# EAGLE schematic bottom (EAGLE 7.2.0)
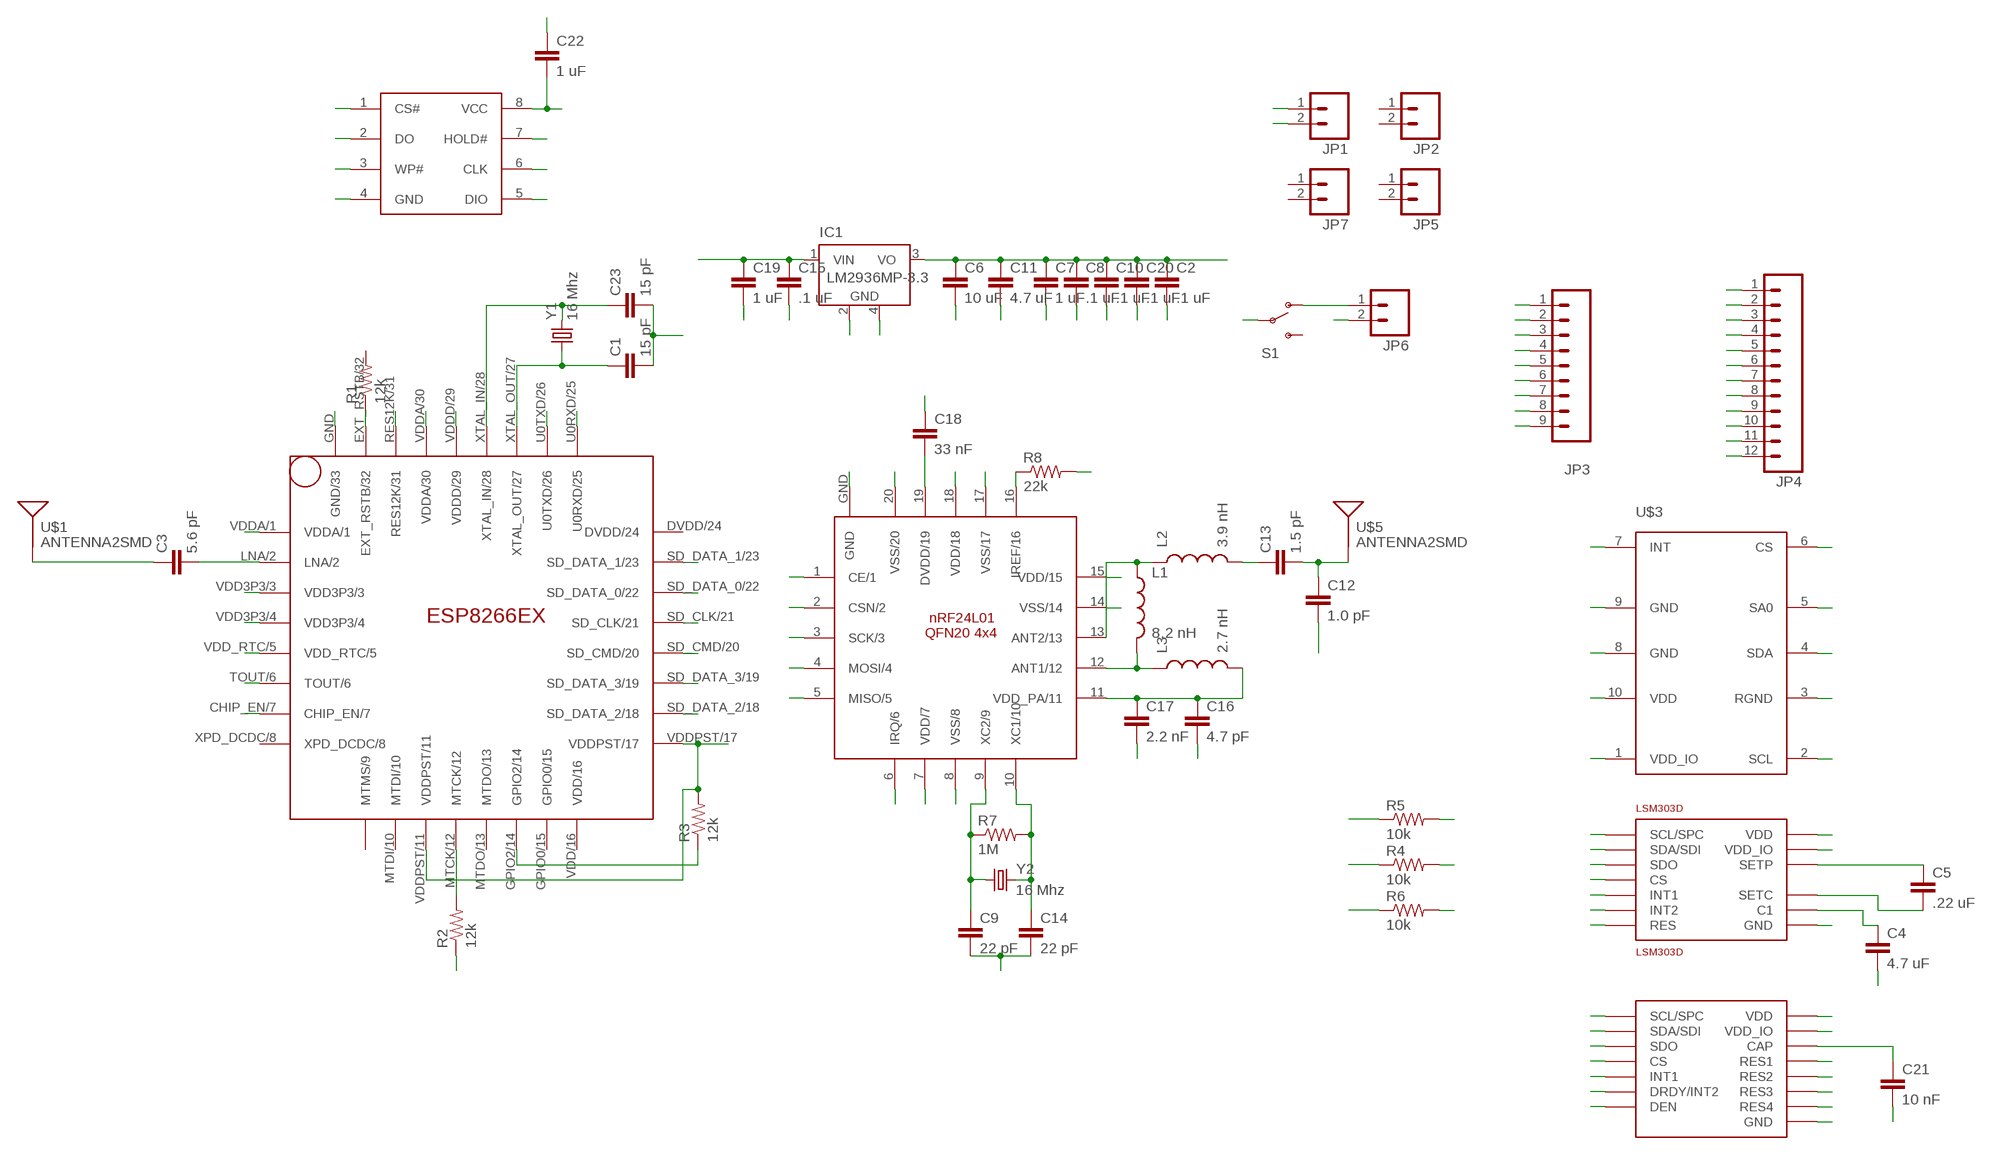
[diagram p0: schematic, sheet 1]

## Parts
C1  15 pF  CAP0603-CAP  [0603-CAP]
C2  .1 uF  CAP0603-CAP  [0603-CAP]
C3  5.6 pF  CAP0603-CAP  [0603-CAP]
C4  4.7 uF  CAP0603-CAP  [0603-CAP]
C5  .22 uF  CAP0603-CAP  [0603-CAP]
C6  10 uF  CAP0603-CAP  [0603-CAP]
C7  1 uF  CAP0603-CAP  [0603-CAP]
C8  .1 uF  CAP0603-CAP  [0603-CAP]
C9  22 pF  CAP0603-CAP  [0603-CAP]
C10  .1 uF  CAP0603-CAP  [0603-CAP]
C11  4.7 uF  CAP0603-CAP  [0603-CAP]
C12  1.0 pF  CAP0603-CAP  [0603-CAP]
C13  1.5 pF  CAP0603-CAP  [0603-CAP]
C14  22 pF  CAP0603-CAP  [0603-CAP]
C15  .1 uF  CAP0603-CAP  [0603-CAP]
C16  4.7 pF  CAP0603-CAP  [0603-CAP]
C17  2.2 nF  CAP0603-CAP  [0603-CAP]
C18  33 nF  CAP0603-CAP  [0603-CAP]
C19  1 uF  CAP0603-CAP  [0603-CAP]
C20  .1 uF  CAP0603-CAP  [0603-CAP]
C21  10 nF  CAP0603-CAP  [0603-CAP]
C22  1 uF  CAP0603-CAP  [0603-CAP]
C23  15 pF  CAP0603-CAP  [0603-CAP]
IC1  LM2936MP-3.3  [SOT223]
JP1  M02LOCK  [1X02_LOCK]
JP2  M02LOCK  [1X02_LOCK]
JP3  M09  [1X09]
JP4  M12PTH  [1X12]
JP5  M02LOCK  [1X02_LOCK]
JP6  M02LOCK  [1X02_LOCK]
JP7  M02LOCK  [1X02_LOCK]
L1  8.2 nH  INDUCTOR0402  [C0402]
L2  3.9 nH  INDUCTOR0402  [C0402]
L3  2.7 nH  INDUCTOR0402  [C0402]
LSM303D  LSM303D  [LGA16L]
MESH  NRF24L01  [QFN20(4X4)]
R1  12k  RESISTOR0603-RES  [0603-RES]
R2  12k  RESISTOR0603-RES  [0603-RES]
R3  12k  RESISTOR0603-RES  [0603-RES]
R4  10k  RESISTOR0603-RES  [0603-RES]
R5  10k  RESISTOR0603-RES  [0603-RES]
R6  10k  RESISTOR0603-RES  [0603-RES]
R7  1M  RESISTOR0603-RES  [0603-RES]
R8  22k  RESISTOR0603-RES  [0603-RES]
S1  SWITCH-SPDT-SMD-A  [SWITCH-SPST-SMD-A]
U$1  ANTENNA2SMD  [ANTENNA-CHIP2]
U$2  25Q40  [SOP8]
U$3  LPS25H  [LPS25H]
U$4  L3GD20H  [LGA16L]
U$5  ANTENNA2SMD  [ANTENNA-CHIP2]
WIFI  ESP8266EX  [QFN32]
Y1  16 Mhz  CRYSTAL5X3  [CRYSTAL-SMD-5X3]
Y2  16 Mhz  CRYSTAL5X3  [CRYSTAL-SMD-5X3]

## Nets
CE: JP3.3 MESH.1(CE/1)
CSN: JP3.4 MESH.2(CSN/2)
GND: C1.2 C2.2 C4.2 C6.2 C7.2 C8.2 C9.2 C10.2 C11.2 C12.2 C14.2 C15.2 C16.2 C17.2 C18.1 C19.2 C20.2 C22.1 C23.2 IC1.2(GND) IC1.4(GND) JP1.2 JP4.1 JP4.2 JP4.3 JP4.4 JP4.5 JP4.6 JP6.2 LSM303D.P$5(GND) LSM303D.P$10(RES) LSM303D.P$12(GND) LSM303D.P$13(GND) LSM303D.P$16(GND) MESH.8(VSS/8) MESH.14(VSS/14) MESH.17(VSS/17) MESH.20(VSS/20) R2.1 R8.2 U$2.4(GND) U$3.3(RGND) U$3.8(GND) U$3.9(GND) U$4.P$8(DEN) U$4.P$9(RES1) U$4.P$10(RES2) U$4.P$11(RES3) U$4.P$12(GND) U$4.P$13(GND) WIFI.GND(GND/33)
IQR: MESH.6(IRQ/6)
MISO: JP3.6 MESH.5(MISO/5)
MOSI: JP3.5 MESH.4(MOSI/4)
N$1: C3.1 U$1.FEED(SIGNAL)
N$2: R3.1 WIFI.GPIO2/14
N$3: R2.2 WIFI.MTCK/12
N$5: L1.2 L3.1 MESH.12(ANT1/12)
N$6: C13.1 L2.2
N$10: C12.1 C13.2 U$5.FEED(SIGNAL)
N$11: U$4.P$7(INT1)
N$12: U$4.P$6(DRDY/INT2)
N$13: C3.2 WIFI.LNA/2
N$14: U$3.7(INT)
N$16: C9.1 MESH.9(XC2/9) R7.1 Y2.1
N$17: C14.1 MESH.10(XC1/10) R7.2 Y2.3
N$18: C16.1 C17.1 L3.2 MESH.11(VDD_PA/11)
N$19: L1.1 L2.1 MESH.13(ANT2/13)
N$22: C21.1 U$4.P$14(CAP)
N$24: MESH.16(IREF/16) R8.1
N$28: C18.2 MESH.19(DVDD/19)
N$30: MESH.GND
N$31: C21.2
N$35: LSM303D.P$11(INT1)
N$36: LSM303D.P$9(INT2)
N$38: WIFI.RES12K/31
N$42: C5.2 LSM303D.P$2(SETC)
N$43: C4.1 LSM303D.P$15(C1)
RST: R1.1 WIFI.EXT_RSTB/32
RTC: WIFI.VDD_RTC/5
RX_W: JP3.1 WIFI.U0TXD/26
SCK: JP3.7 MESH.3(SCK/3)
SCL: JP3.9 LSM303D.P$4(SCL/SPC) R4.2 U$3.2(SCL) U$4.P$2(SCL/SPC)
SD-CLK: U$2.6(CLK) WIFI.SD_CLK/21
SD-CMD: U$2.1(CS#) WIFI.SD_CMD/20
SD-D0: U$2.2(DO) WIFI.SD_DATA_0/22
SD-D1: U$2.5(DIO) WIFI.SD_DATA_1/23
SD-D2: U$2.7(HOLD#) WIFI.SD_DATA_2/18
SD-D3: U$2.3(WP#) WIFI.SD_DATA_3/19
SDA: JP3.8 LSM303D.P$6(SDA/SDI) R5.2 U$3.4(SDA) U$4.P$3(SDA/SDI)
SDO: LSM303D.P$7(SDO) R6.2 U$3.5(SA0) U$4.P$4(SDO)
SETP: C5.1 LSM303D.P$3(SETP)
TOUT: WIFI.TOUT/6
TX_W: JP3.2 WIFI.U0RXD/25
VDD: C2.1 C6.1 C7.1 C8.1 C10.1 C11.1 C20.1 C22.2 IC1.3(VO) JP1.1 JP4.7 JP4.8 JP4.9 JP4.10 JP4.11 JP4.12 LSM303D.P$1(VDD_IO) LSM303D.P$8(CS) LSM303D.P$14(VDD) MESH.7(VDD/7) MESH.15(VDD/15) MESH.18(VDD/18) R3.2 R4.1 R5.1 R6.1 U$2.8(VCC) U$3.1(VDD_IO) U$3.6(CS) U$3.10(VDD) U$4.P$1(VDD_IO) U$4.P$5(CS) U$4.P$15(RES4) U$4.P$16(VDD) WIFI.CHIP_EN/7 WIFI.VDD3P3/3 WIFI.VDD3P3/4 WIFI.VDDA/1 WIFI.VDDA/30 WIFI.VDDD/29 WIFI.VDDPST/11 WIFI.VDDPST/17
VIN: JP6.1 S1.1(O)
VRAW: C15.1 C19.1 IC1.1(VIN) S1.2(P)
XTAL_IN: C23.1 WIFI.XTAL_IN/28 Y1.3
XTAL_OUT: C1.1 WIFI.XTAL_OUT/27 Y1.1
Unconnected: JP2.1 JP2.2 JP5.1 JP5.2 JP7.1 JP7.2 R1.2 S1.3(S) WIFI.DVDD/24 WIFI.GPIO0/15 WIFI.MTDI/10 WIFI.MTDO/13 WIFI.MTMS/9 WIFI.VDD/16 WIFI.XPD_DCDC/8

## Library data of the parts
C1-C23 = SparkFun-Capacitors:CAP: Capacitor Standard 0603 ceramic capacitor, and 0.1" leaded capacitor.
IC1 = national-semiconductor:LM2936MP?*: Ultra-Low Quiescent Current LDO Voltage Regulator Source: Data sheet <http://www.national.com/ds/LM/LM2936.pdf>; MF: NATIONAL SEMICONDUCTOR; MPN: LM2936MP-3.3/NOPB; OC_FARNELL: 1469062; OC_NEWARK: 41K4523
JP1 JP2 JP5-JP7 = SparkFun-Connectors:M02: Standard 2-pin 0.1" header. Use with - straight break away headers ( PRT-00116) - right angle break away headers (PRT-00553) - swiss pins (PRT-00743) - machine pins (PRT-00117) - female headers (PRT-00115) Molex polarized connector foot print use with: PRT-08233 with associated crimp pins and housings. 2.54_SCREWTERM for use with PRT-10571. 3.5mm Screw Terminal footprints for PRT-08084 5mm Screw Terminal footprints for use with PRT-08432
JP3 = SparkFun-Connectors:M09: Header 9 Standard 9-pin 0.1" header. Use with straight break away headers (SKU : PRT-00116), right angle break away headers (PRT-00553), swiss pins (PRT-00743), machine pins (PRT-00117), and female headers (PRT-00115).
JP4 = SparkFun-Connectors:M12: Header 12 Standard 12-pin 0.1" header. Use with straight break away headers (SKU : PRT-00116), right angle break away headers (PRT-00553), swiss pins (PRT-00743), machine pins (PRT-00117), and female headers (PRT-00115).
L1-L3 = SparkFun-Passives:INDUCTOR: Inductors Basic Inductor/Choke - 0603 and 1206. Footprints are not proven and vary greatly between part numbers. INDUCTOR POWER 3.3UH 4.0A SMD 0.197" L x 0.197" W x 0.177" H (5.00mm x 5.00mm x 4.50mm)
LSM303D = st:LSM303D
MESH = RF:NRF24L01
R1-R8 = SparkFun-Resistors:RESISTOR: Resistor Basic schematic elements and footprints for 0603, 1206, and PTH resistors.
S1 = SparkFun-Electromechanical:SWITCH-SPDT: SPDT Switch Simple slide switch, Spark Fun Electronics SKU : COM-00102 DPDT SMT slide switch, AYZ0202, SWCH-08179
U$1 U$5 = SparkFun-RF:ANTENNA2: Chip antenna Single endded antenna. Common with smaller chip antennas. CHIP4 package is the GPS Chip Antenna SKU: GPS-08418. CHIP5 package is 2.4GHz chip antenna SKU: WRL-00144.
U$2 = wifi:25Q40
U$3 = chips:LPS25H: ST-Micro Piezoresistive pressure sensor; DIGIKEY: 497-15070-1-ND
U$4 = st:L3GD20H
WIFI = wifi:ESP8266EX
Y1 Y2 = SparkFun-FreqCtrl:CRYSTAL: Various standard crystals. Proven footprints.; PROD_ID: XTAL-08218